# Altium schematic sheet Arduino幻彩灯带.SchDoc
size A3
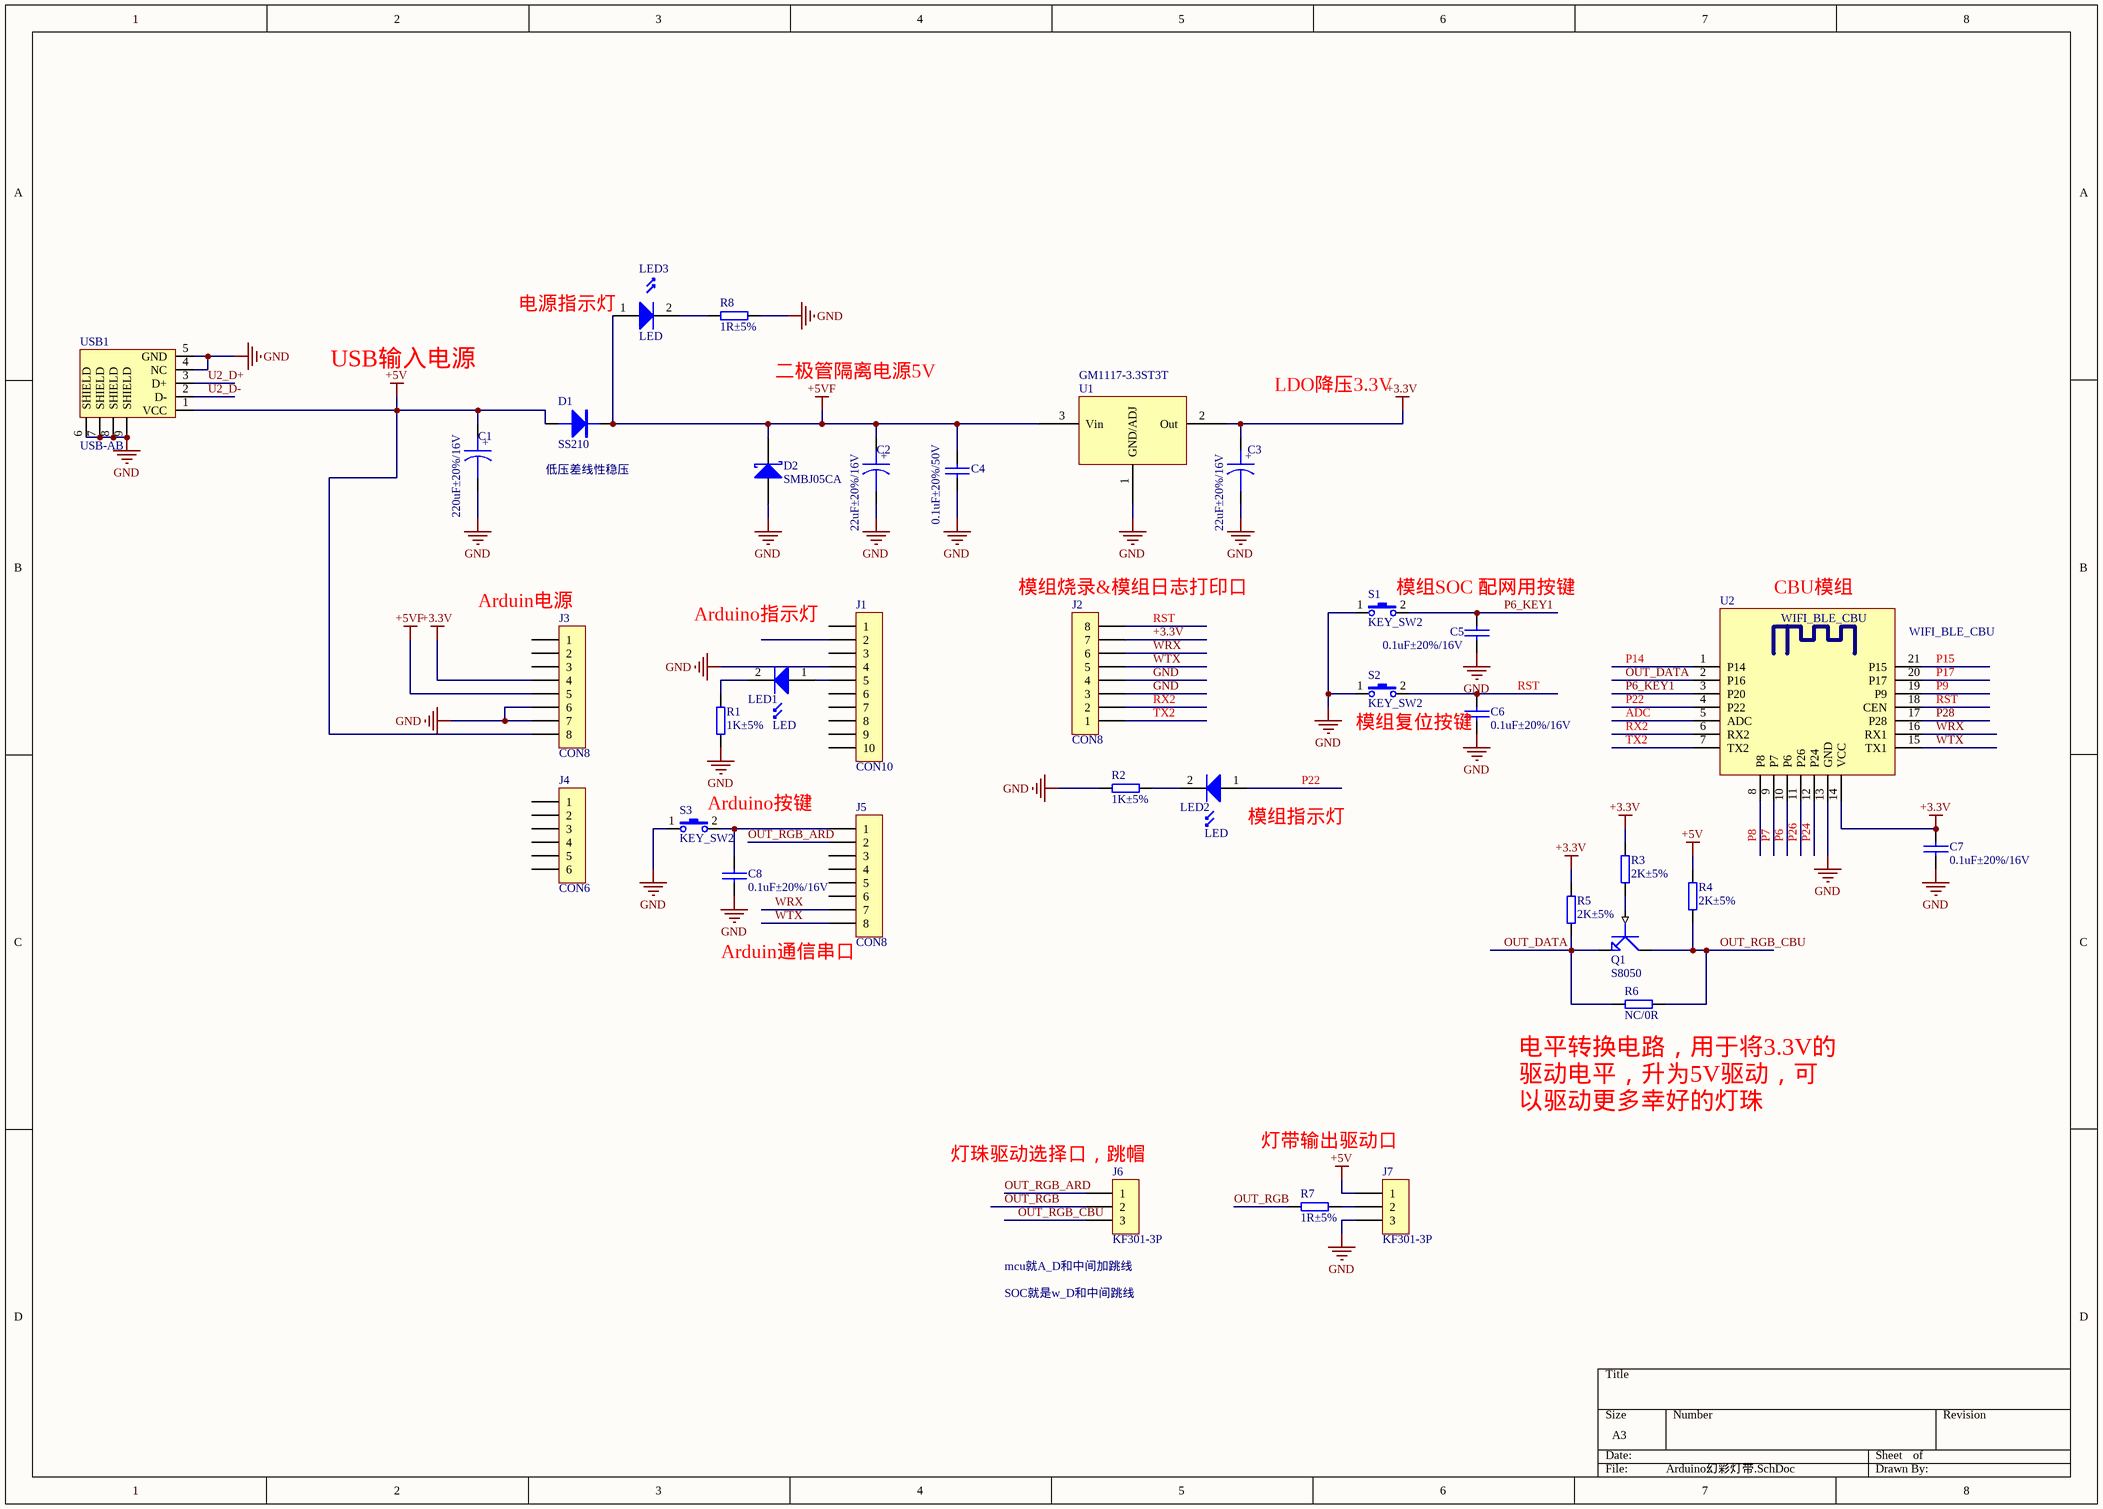
[diagram p0: Arduino幻彩灯带.SchDoc]

## Parts
C1  220uF±20%/16V  [CD0.15]
C2  22uF±20%/16V  [钽电容B3528]
C3  22uF±20%/16V  [钽电容B3528]
C4  0.1uF±20%/50V  [0805C]
C5  0.1uF±20%/16V  [0805C]
C6  0.1uF±20%/16V  [0805C]
C7  0.1uF±20%/16V  [0805C]
C8  0.1uF±20%/16V  [0805C]
D1  SS210  [SMA(DO-214AC)]
D2  SMBJ05CA  [SMB(DO-214AA)]
J1  CON10  [HDR1X10Z]
J2  CON8  [HDR1X8Z]
J3  CON8  [HDR1X8Z]
J4  CON6  [HDR1X6Z]
J5  CON8  [HDR1X8Z]
J6  KF301-3P  [SIP3 - 2.54]
J7  KF301-3P  [SIP3 - 2.54]
LED1  LED  [LED0805_1]
LED2  LED  [LED0805_1]
LED3  LED  [LED0805_1]
Q1  S8050  [SOT-23-NPN]
R1  1K±5%  [0805R]
R2  1K±5%  [0805R]
R3  2K±5%  [0805R]
R4  2K±5%  [0805R]
R5  2K±5%  [0805R]
R6  NC/0R  [0805R]
R7  1R±5%  [0805R]
R8  1R±5%  [0805R]
S1  KEY_SW2  [Button3*6]
S2  KEY_SW2  [Button3*6]
S3  KEY_SW2  [Button3*6]
U1  GM1117-3.3ST3T  [SOT-223]
U2  WIFI_BLE_CBU  [WIFI_BLE_CBU]
USB1  USB-AB  [USB_AB_EX]

## Nets
+3.3V: C3.1 C7.2 J2.7 J3.4 R3.1 R5.1 U1.2(Out) U2.14(VCC)
+5V: C1.1 D1.1 J3.8 J7.1 R4.1 USB1.1(VCC)
+5VF: C2.1 C4.1 D1.2 D2.2(K) J3.5 LED3.1 U1.3(Vin)
GND: C1.2 C2.2 C3.2 C4.2 C5.1 C6.2 C7.1 C8.1 D2.1(A) J1.4 J2.3 J2.4 J3.6 J3.7 J7.3 R1.1 R2.2 R8.2 S1.1 S2.1 S3.1 U1.1(GND/ADJ) U2.13(GND) USB1.4(NC) USB1.5(GND) USB1.6(SHIELD) USB1.7(SHIELD) USB1.8(SHIELD) USB1.9(SHIELD)
ADC: U2.5(ADC)
OUT_DATA: Q1.1(E) R5.2 R6.1 U2.2(P16)
OUT_RGB: J6.2 R7.1
OUT_RGB_ARD: J5.2 J6.1
OUT_RGB_CBU: J6.3 Q1.3(C) R4.2 R6.2
P6: U2.10(P6)
P6_KEY1: C5.2 S1.2 U2.3(P20)
P7: U2.9(P7)
P8: U2.8(P8)
P9: U2.19(P9)
P14: U2.1(P14)
P15: U2.21(P15)
P17: U2.20(P17)
P22: LED2.1 U2.4(P22)
P24: U2.12(P24)
P26: U2.11(P26)
P28: U2.17(P28)
RST: C6.1 J2.8 S2.2 U2.18(CEN)
RX2: J2.2 U2.6(RX2)
TX2: J2.1 U2.7(TX2)
U2_D+: USB1.3(D+)
U2_D-: USB1.2(D-)
WRX: J2.6 J5.7 U2.16(RX1)
WTX: J2.5 J5.8 U2.15(TX1)
NetC8_2: C8.2 J5.1 S3.2
NetJ1_5: J1.5 LED1.1
NetJ7_2: J7.2 R7.2
NetLED1_2: LED1.2 R1.2
NetLED2_2: LED2.2 R2.1
NetLED3_2: LED3.2 R8.1
NetQ1_2: Q1.2(B) R3.2

Not connected (* = marked no-connect by the designer): J1 1 2 3 6 7 8 9 10; J3 1 2 3; J4 1 2 3 4 5 6; J5 3 4 5 6

## Notes on the sheet
- 电源指示灯
- USB输入电源
- 二极管隔离电源5V
- LDO降压3.3V
- (near D1) 低压差线性稳压
- (near J3) Arduin电源
- Arduino指示灯
- (near J2) 模组烧录&模组日志打印口
- (near S1) 模组SOC 配网用按键
- CBU模组
- (near S2) 模组复位按键
- (near S3) Arduino按键
- (near LED2) 模组指示灯
- Arduin通信串口
- 灯珠驱动选择口，跳帽
- 灯带输出驱动口
- (near R6) 电平转换电路，用于将3.3V的驱动电平，升为5V驱动，可以驱动更多幸好的灯珠
- (near J6) mcu就A_D和中间加跳线
- SOC就是w_D和中间跳线
- (in symbol CAPACITOR POL) +

## Library data of the parts
C1-C3 = CAPACITOR POL: Capacitor
C4-C8 = CAP: Capacitor
D1 = Diode1: Diode
D2 = D Schottky: Schottky Diode; MFR: Toshiba
J1 = CON10: Connector
J2 J3 J5 = CON8: Connector
J4 = CON6: Connector
J6 J7 = CON3: Connector
Q1 = NPN: NPN Transistor
R1-R8 = RES5
U1 = GM1117
U2 = WIFI_BLE_CBU: Module
USB1 = USB-AB: MicroUSB
LED1-LED3 = LED: Published: *; LatestRevisionDate: *; LatestRevisionNote: *; DatasheetDocument: *; PackageDocument: *; PackageReference: *; Publisher: *; ComponentLink1Description: *; ComponentLink1URL: *; Code_JEDEC: *